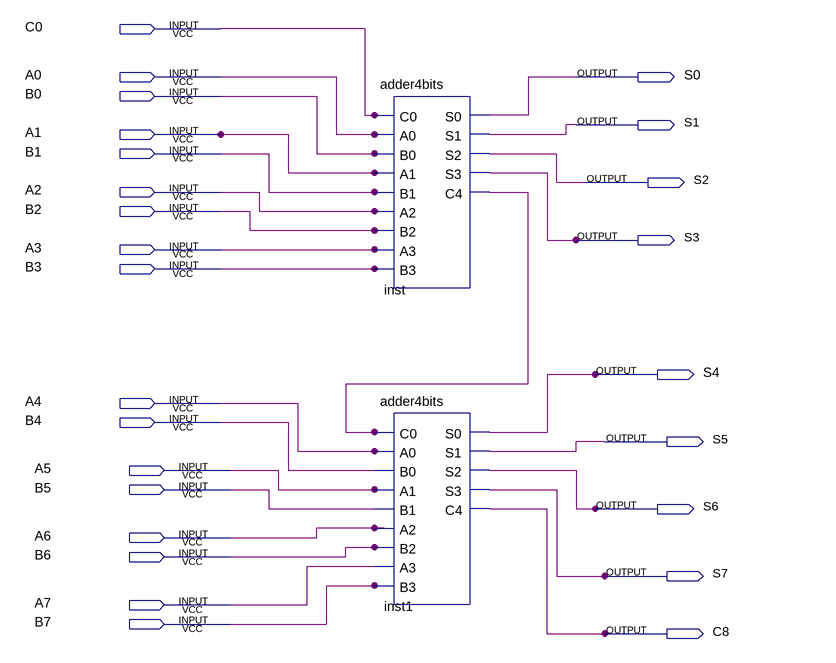
[diagram p0: schematic sheet]
// Quartus schematic adder8bits.bdf as structural Verilog: 2 symbols, 26 pins
module adder8bits (
  input  C0,
  input  A0,
  input  B0,
  input  A1,
  input  B1,
  input  A2,
  input  B2,
  input  A3,
  input  B3,
  input  A4,
  input  B4,
  input  A5,
  input  B5,
  input  A6,
  input  B6,
  input  A7,
  input  B7,
  output S0,
  output S1,
  output S2,
  output S3,
  output S4,
  output S5,
  output S6,
  output S7,
  output C8
);

  wire inst_c4;

  adder4bits inst (
    .C0(C0), .A0(A0), .B0(B0), .A1(A1), .B1(B1), .A2(A2), .B2(B2), .A3(A3), .B3(B3), .S0(S0), .S1(S1),
    .S2(S2), .S3(S3), .C4(inst_c4));
  adder4bits inst1 (
    .C0(inst_c4), .A0(A4), .B0(B4), .A1(A5), .B1(B5), .A2(A6), .B2(B6), .A3(A7), .B3(B7), .S0(S4), .S1(S5),
    .S2(S6), .S3(S7), .C4(C8));
endmodule
